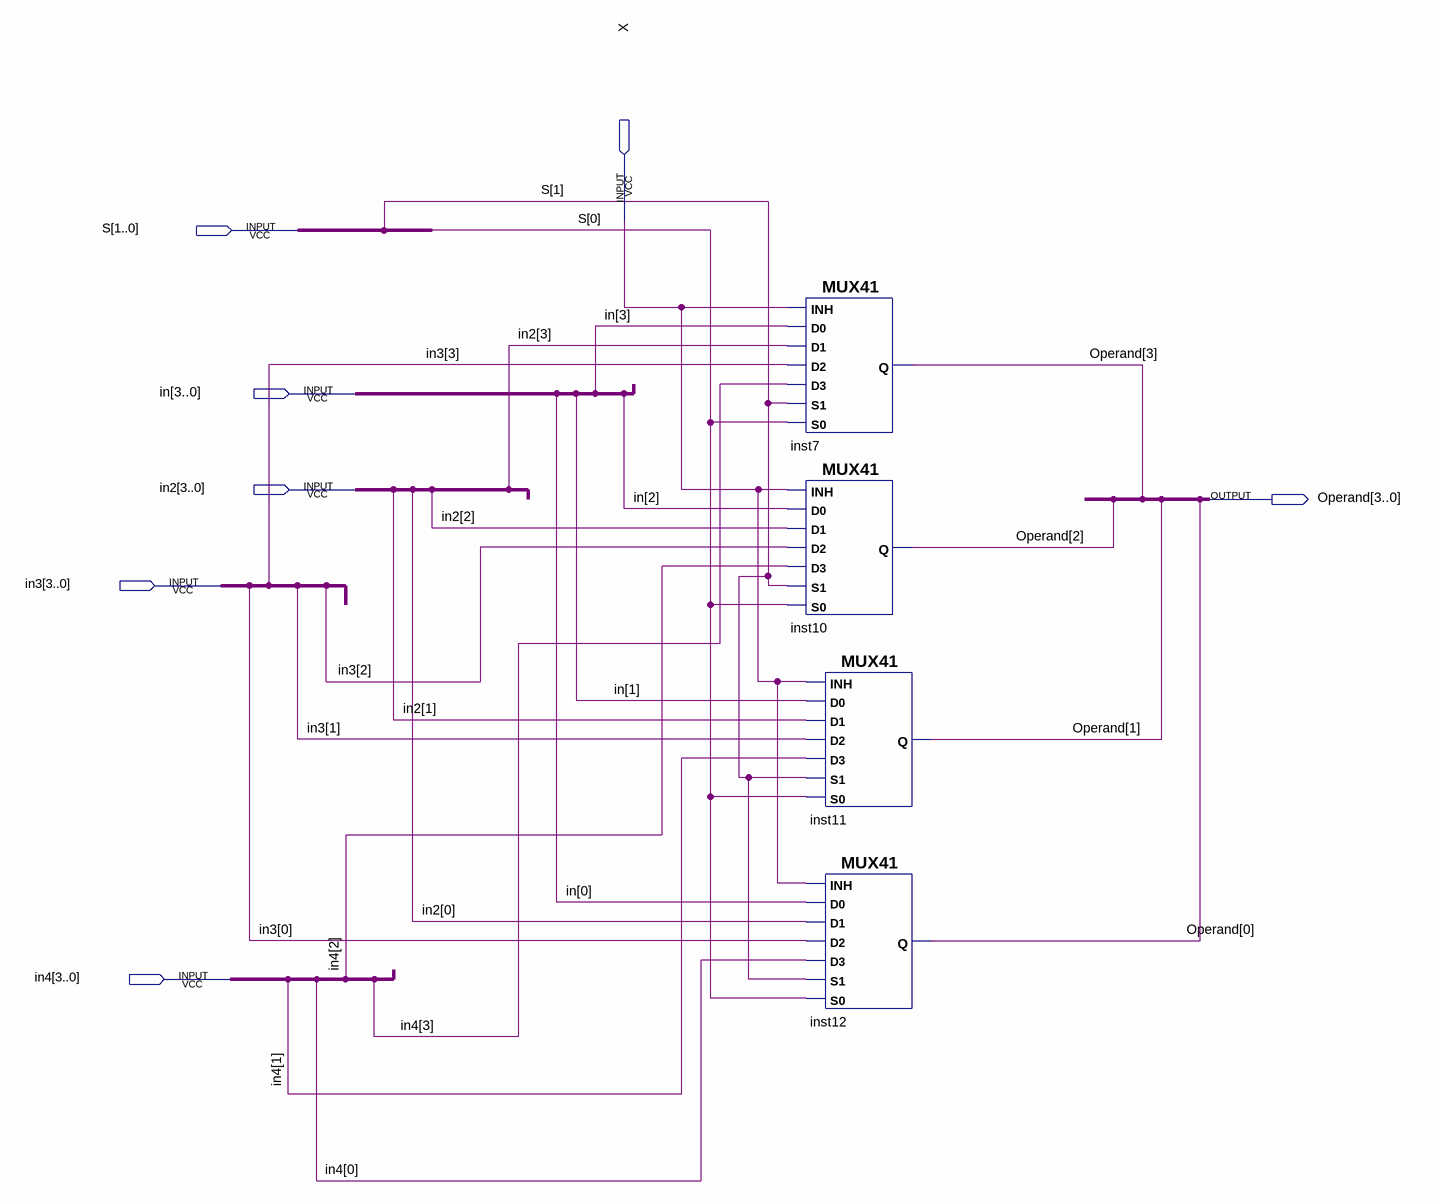
[diagram p0: schematic sheet]
// Quartus schematic Block3.bdf as structural Verilog: 4 symbols, 7 pins
module Block3 (
  input  X,
  input  [1:0] S,
  input  [3:0] in,
  input  [3:0] in2,
  input  [3:0] in3,
  input  [3:0] in4,
  output [3:0] Operand
);

  MUX41 inst7 (.S0(S[0]), .D2(in3[3]), .S1(S[1]), .D3(in4[3]), .D0(in[3]), .INH(X), .D1(in2[3]), .Q(Operand[3]));
  MUX41 inst10 (.S0(S[0]), .D2(in3[2]), .S1(S[1]), .D3(in4[2]), .D0(in[2]), .INH(X), .D1(in2[2]), .Q(Operand[2]));
  MUX41 inst11 (.S0(S[0]), .D2(in3[1]), .S1(S[1]), .D3(in4[1]), .D0(in[1]), .INH(X), .D1(in2[1]), .Q(Operand[1]));
  MUX41 inst12 (.S0(S[0]), .D2(in3[0]), .S1(S[1]), .D3(in4[0]), .D0(in[0]), .INH(X), .D1(in2[0]), .Q(Operand[0]));
endmodule
